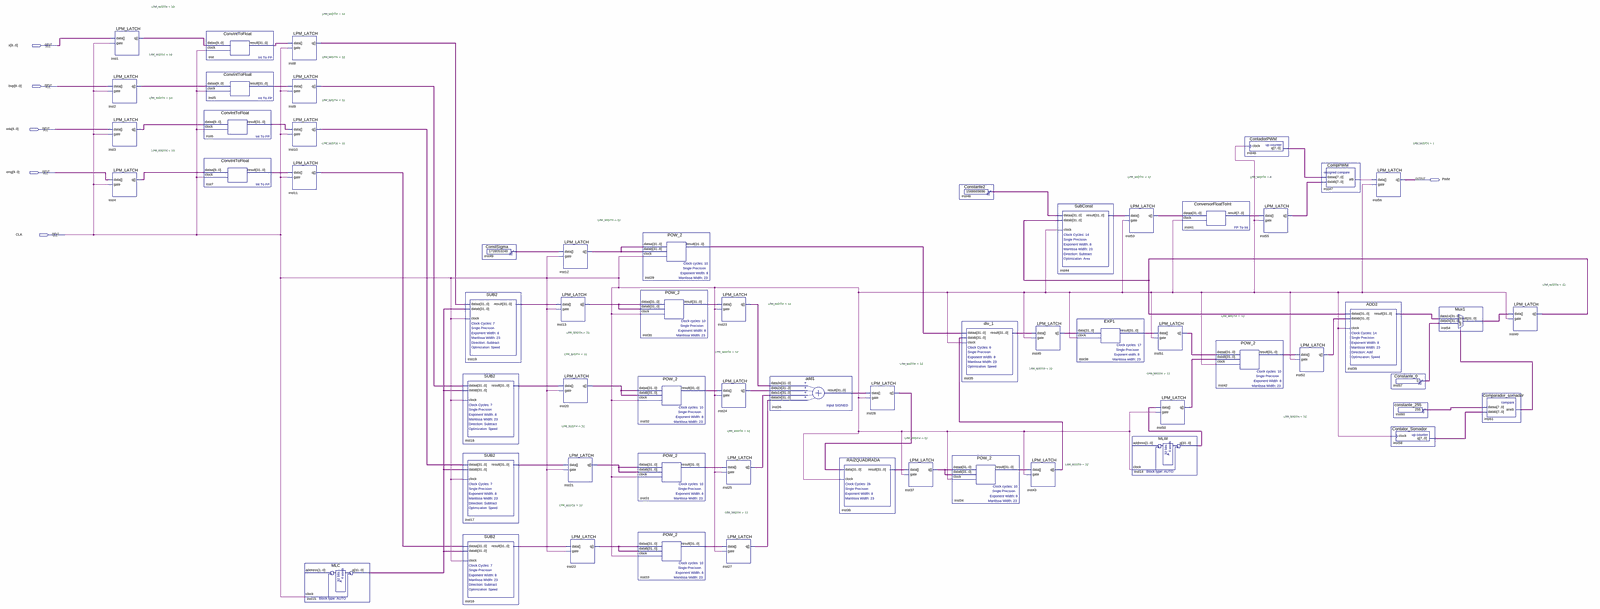
[diagram p0: schematic sheet, whole]
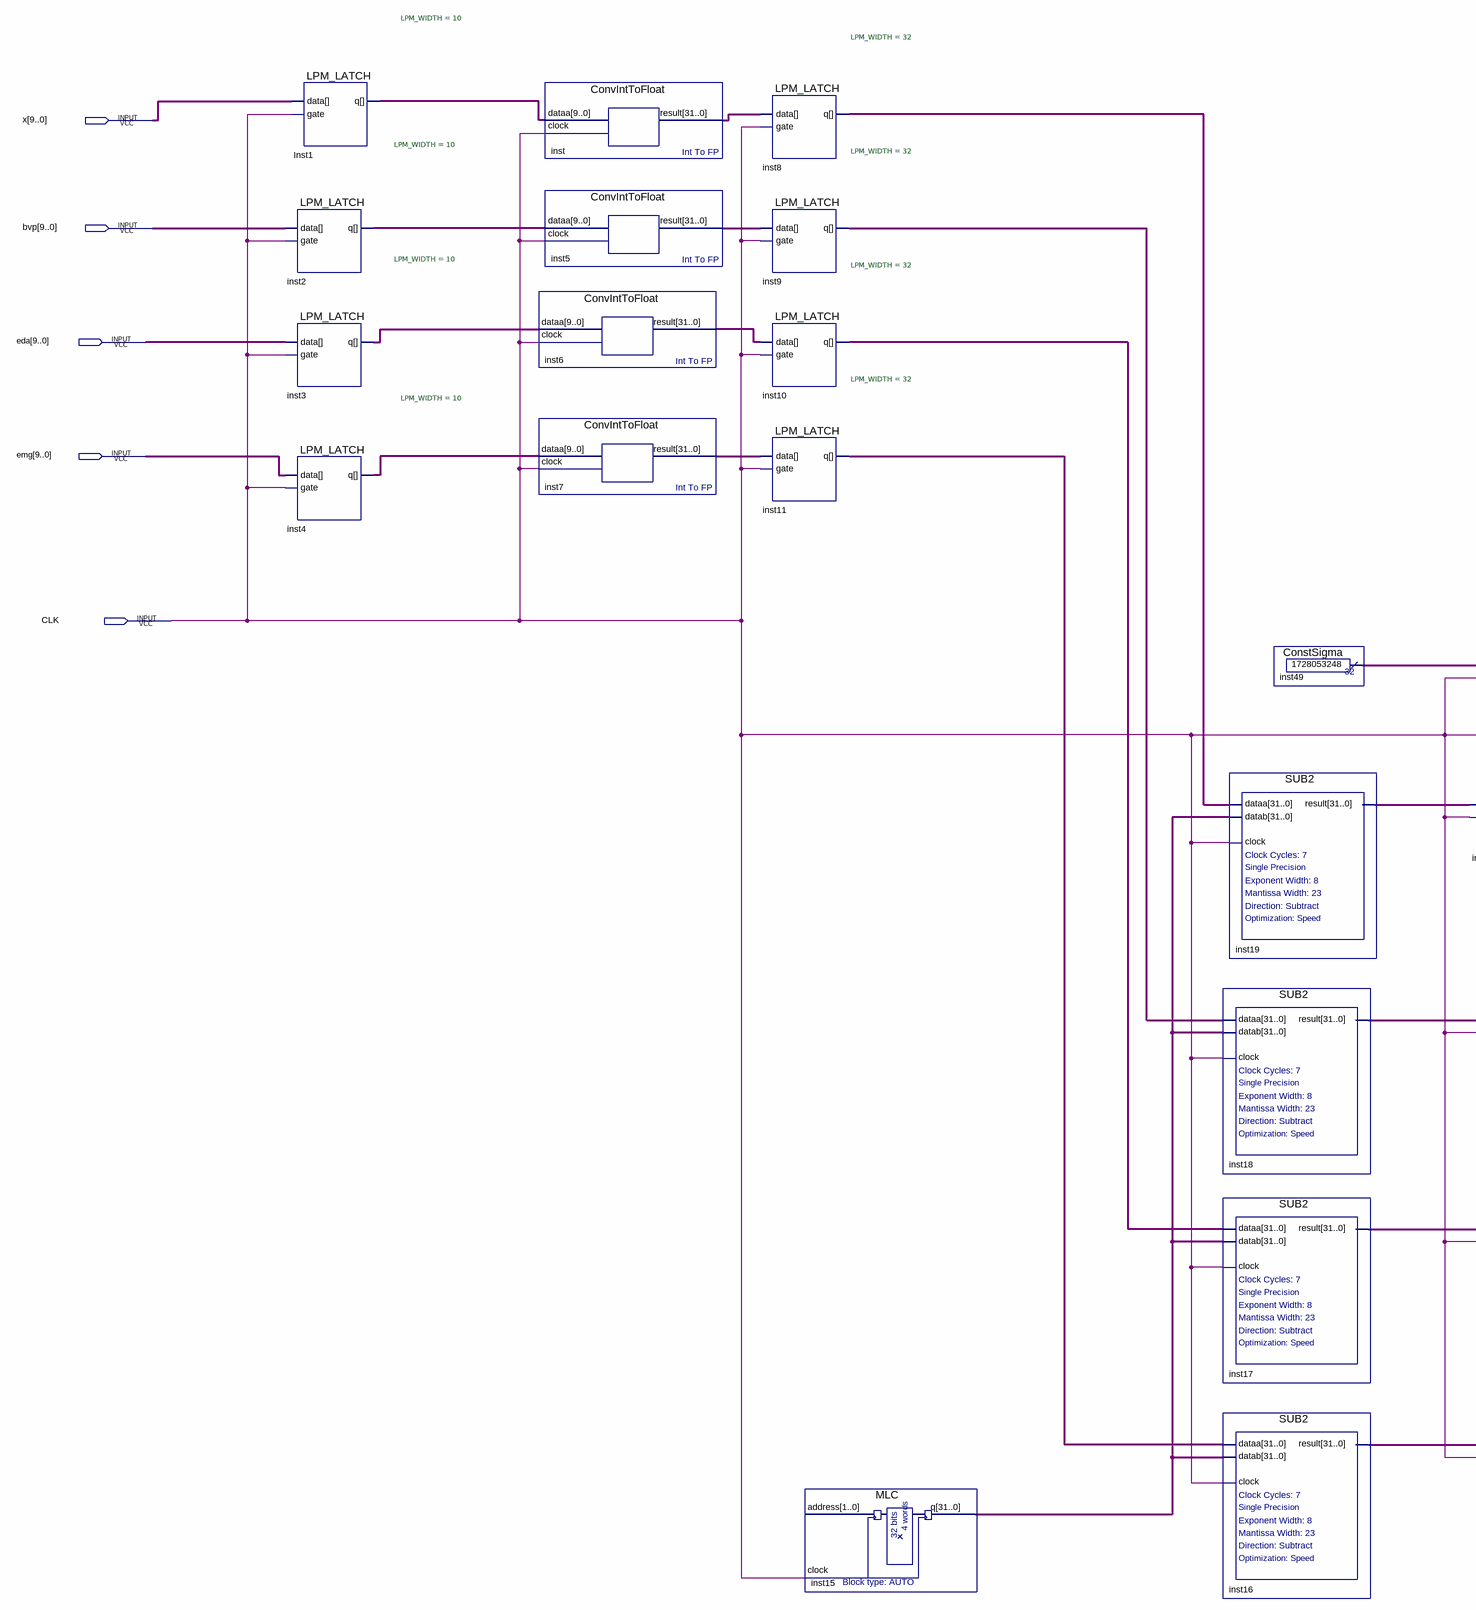
[diagram p1: schematic sheet, left part]
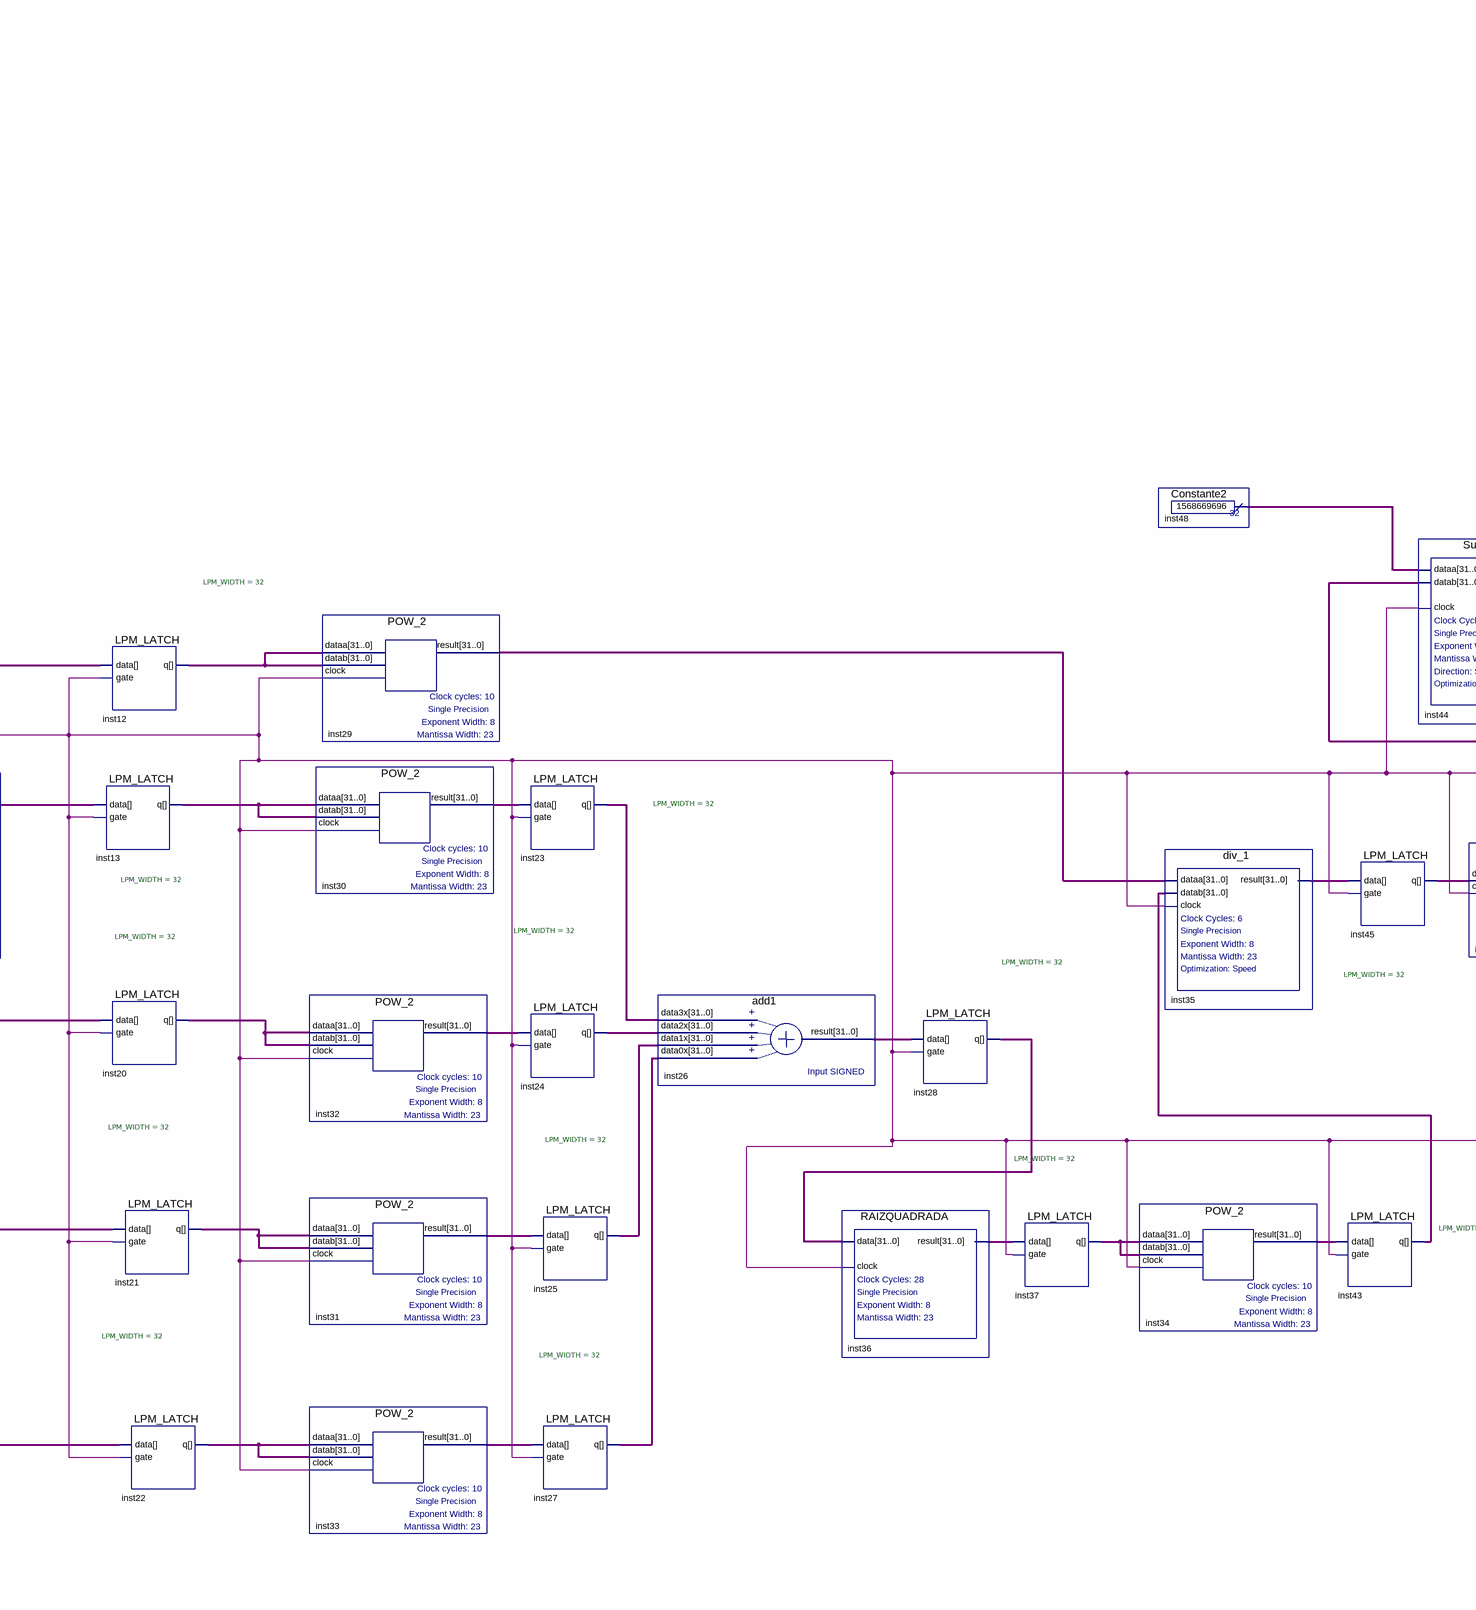
[diagram p2: schematic sheet, centre part]
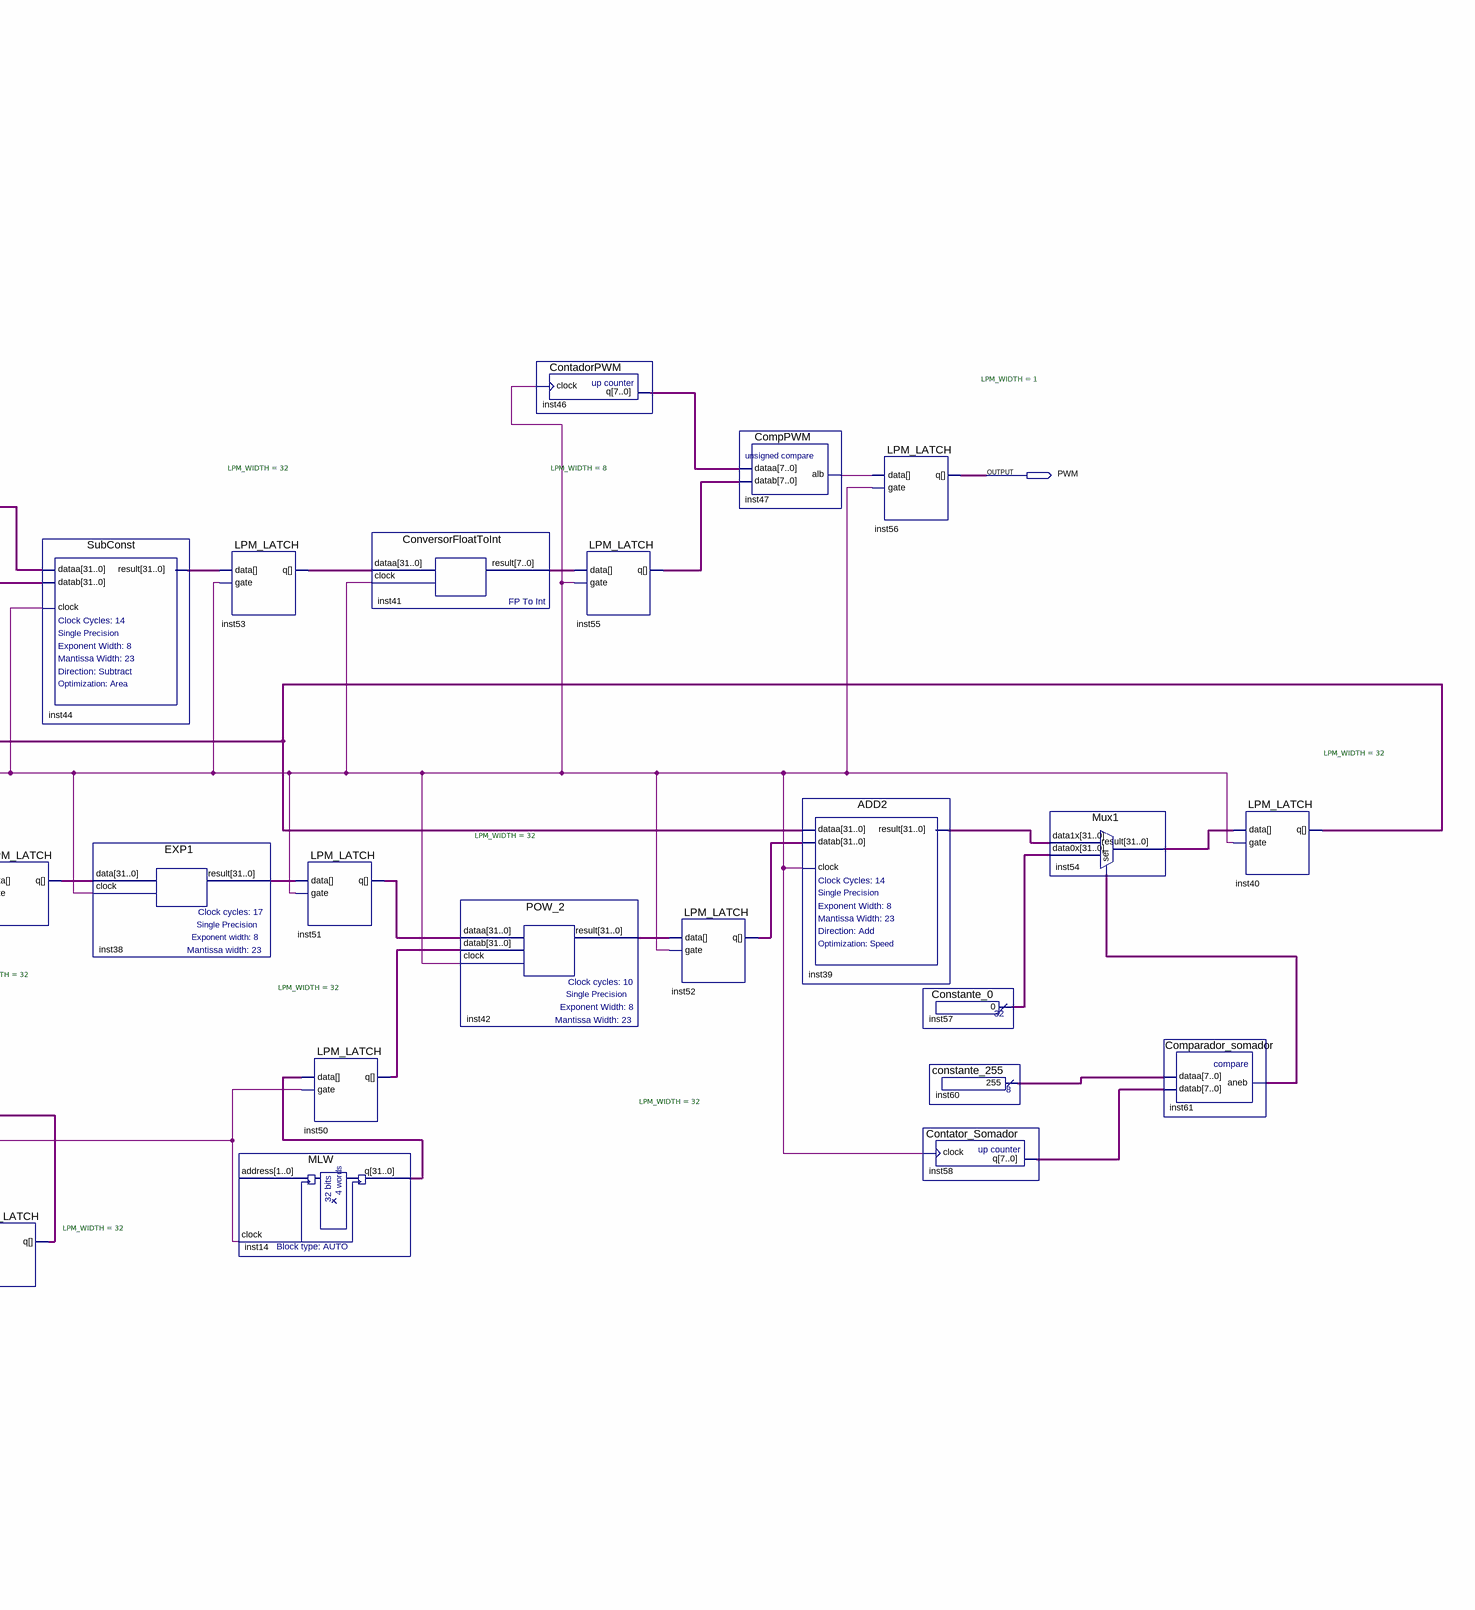
[diagram p3: schematic sheet, right part]
// Quartus schematic identificadorDeEstadoFPGA.bdf as structural Verilog: 61 symbols, 6 pins
module identificadorDeEstadoFPGA (
  input  [9:0] x,
  input  [9:0] bvp,
  input  [9:0] eda,
  input  [9:0] emg,
  input  CLK,
  output PWM
);

  wire inst47_alb, inst61_aneb;
  wire [7:0] inst41_result, inst46_q, inst55_q, inst58_q, inst60_result;
  wire [9:0] Inst1_q, inst2_q, inst3_q, inst4_q;
  wire [31:0] inst5_result, inst6_result, inst7_result, inst8_q, inst9_q, inst10_q, inst11_q, inst12_q,
       inst13_q, inst14_q, inst15_q, inst16_result, inst17_result, inst18_result, inst19_result, inst20_q,
       inst21_q, inst22_q, inst23_q, inst24_q, inst25_q, inst26_result, inst27_q, inst28_q, inst29_result,
       inst30_result, inst31_result, inst32_result, inst33_result, inst34_result, inst35_result,
       inst36_result, inst37_q, inst38_result, inst39_result, inst40_q, inst42_result, inst43_q,
       inst44_result, inst45_q, inst48_result, inst49_result, inst50_q, inst51_q, inst52_q, inst53_q,
       inst54_result, inst57_result, inst_result;

  LPM_LATCH #(.LPM_WIDTH(10)) Inst1 (.data(x), .gate(CLK), .q(Inst1_q));
  LPM_LATCH #(.LPM_WIDTH(10)) inst2 (.data(bvp), .gate(CLK), .q(inst2_q));
  LPM_LATCH #(.LPM_WIDTH(10)) inst3 (.data(eda), .gate(CLK), .q(inst3_q));
  LPM_LATCH #(.LPM_WIDTH(10)) inst4 (.data(emg), .gate(CLK), .q(inst4_q));
  ConvIntToFloat inst (.dataa(Inst1_q), .clock(CLK), .result(inst_result));
  ConvIntToFloat inst5 (.dataa(inst2_q), .clock(CLK), .result(inst5_result));
  ConvIntToFloat inst6 (.dataa(inst3_q), .clock(CLK), .result(inst6_result));
  ConvIntToFloat inst7 (.dataa(inst4_q), .clock(CLK), .result(inst7_result));
  LPM_LATCH #(.LPM_WIDTH(32)) inst8 (.data(inst_result), .gate(CLK), .q(inst8_q));
  LPM_LATCH #(.LPM_WIDTH(32)) inst9 (.data(inst5_result), .gate(CLK), .q(inst9_q));
  LPM_LATCH #(.LPM_WIDTH(32)) inst10 (.data(inst6_result), .gate(CLK), .q(inst10_q));
  LPM_LATCH #(.LPM_WIDTH(32)) inst11 (.data(inst7_result), .gate(CLK), .q(inst11_q));
  MLC inst15 (.clock(CLK), .q(inst15_q));  // open: address
  SUB2 inst18 (.dataa(inst9_q), .datab(inst15_q), .clock(CLK), .result(inst18_result));
  SUB2 inst17 (.dataa(inst10_q), .datab(inst15_q), .clock(CLK), .result(inst17_result));
  SUB2 inst16 (.dataa(inst11_q), .datab(inst15_q), .clock(CLK), .result(inst16_result));
  ConstSigma inst49 (.result(inst49_result));
  SUB2 inst19 (.dataa(inst8_q), .datab(inst15_q), .clock(CLK), .result(inst19_result));
  LPM_LATCH #(.LPM_WIDTH(32)) inst12 (.data(inst49_result), .gate(CLK), .q(inst12_q));
  LPM_LATCH #(.LPM_WIDTH(32)) inst13 (.data(inst19_result), .gate(CLK), .q(inst13_q));
  LPM_LATCH #(.LPM_WIDTH(32)) inst20 (.data(inst18_result), .gate(CLK), .q(inst20_q));
  LPM_LATCH #(.LPM_WIDTH(32)) inst21 (.data(inst17_result), .gate(CLK), .q(inst21_q));
  LPM_LATCH #(.LPM_WIDTH(32)) inst22 (.data(inst16_result), .gate(CLK), .q(inst22_q));
  POW_2 inst29 (.dataa(inst12_q), .datab(inst12_q), .clock(CLK), .result(inst29_result));
  POW_2 inst30 (.dataa(inst13_q), .datab(inst13_q), .clock(CLK), .result(inst30_result));
  POW_2 inst32 (.dataa(inst20_q), .datab(inst20_q), .clock(CLK), .result(inst32_result));
  POW_2 inst31 (.dataa(inst21_q), .datab(inst21_q), .clock(CLK), .result(inst31_result));
  POW_2 inst33 (.dataa(inst22_q), .datab(inst22_q), .clock(CLK), .result(inst33_result));
  LPM_LATCH #(.LPM_WIDTH(32)) inst23 (.data(inst30_result), .gate(CLK), .q(inst23_q));
  LPM_LATCH #(.LPM_WIDTH(32)) inst24 (.data(inst32_result), .gate(CLK), .q(inst24_q));
  LPM_LATCH #(.LPM_WIDTH(32)) inst25 (.data(inst31_result), .gate(CLK), .q(inst25_q));
  LPM_LATCH #(.LPM_WIDTH(32)) inst27 (.data(inst33_result), .gate(CLK), .q(inst27_q));
  add1 inst26 (.data3x(inst23_q), .data2x(inst24_q), .data1x(inst25_q), .data0x(inst27_q), .result(inst26_result));
  RAIZQUADRADA inst36 (.data(inst28_q), .clock(CLK), .result(inst36_result));
  LPM_LATCH #(.LPM_WIDTH(32)) inst28 (.data(inst26_result), .gate(CLK), .q(inst28_q));
  LPM_LATCH #(.LPM_WIDTH(32)) inst37 (.data(inst36_result), .gate(CLK), .q(inst37_q));
  Constante2 inst48 (.result(inst48_result));
  div_1 inst35 (.dataa(inst29_result), .datab(inst43_q), .clock(CLK), .result(inst35_result));
  POW_2 inst34 (.dataa(inst37_q), .datab(inst37_q), .clock(CLK), .result(inst34_result));
  LPM_LATCH #(.LPM_WIDTH(32)) inst45 (.data(inst35_result), .gate(CLK), .q(inst45_q));
  LPM_LATCH #(.LPM_WIDTH(32)) inst43 (.data(inst34_result), .gate(CLK), .q(inst43_q));
  SubConst inst44 (.dataa(inst48_result), .datab(inst40_q), .clock(CLK), .result(inst44_result));
  EXP1 inst38 (.data(inst45_q), .clock(CLK), .result(inst38_result));
  LPM_LATCH #(.LPM_WIDTH(32)) inst53 (.data(inst44_result), .gate(CLK), .q(inst53_q));
  MLW inst14 (.clock(CLK), .q(inst14_q));  // open: address
  LPM_LATCH #(.LPM_WIDTH(32)) inst51 (.data(inst38_result), .gate(CLK), .q(inst51_q));
  LPM_LATCH #(.LPM_WIDTH(32)) inst50 (.data(inst14_q), .gate(CLK), .q(inst50_q));
  ConversorFloatToInt inst41 (.dataa(inst53_q), .clock(CLK), .result(inst41_result));
  POW_2 inst42 (.dataa(inst51_q), .datab(inst50_q), .clock(CLK), .result(inst42_result));
  ContadorPWM inst46 (.clock(CLK), .q(inst46_q));
  LPM_LATCH #(.LPM_WIDTH(8)) inst55 (.data(inst41_result), .gate(CLK), .q(inst55_q));
  LPM_LATCH #(.LPM_WIDTH(32)) inst52 (.data(inst42_result), .gate(CLK), .q(inst52_q));
  CompPWM inst47 (.dataa(inst46_q), .datab(inst55_q), .alb(inst47_alb));
  ADD2 inst39 (.dataa(inst40_q), .datab(inst52_q), .clock(CLK), .result(inst39_result));
  LPM_LATCH #(.LPM_WIDTH(1)) inst56 (.data(inst47_alb), .gate(CLK), .q(PWM));
  Constante_0 inst57 (.result(inst57_result));
  constante_255 inst60 (.result(inst60_result));
  Contator_Somador inst58 (.clock(CLK), .q(inst58_q));
  Mux1 inst54 (.data1x(inst39_result), .data0x(inst57_result), .sel(inst61_aneb), .result(inst54_result));
  Comparador_somador inst61 (.dataa(inst60_result), .datab(inst58_q), .aneb(inst61_aneb));
  LPM_LATCH #(.LPM_WIDTH(32)) inst40 (.data(inst54_result), .gate(CLK), .q(inst40_q));
endmodule
